# Altium schematic sheet BDSHOT_TX.SchDoc
size 420 x 297 mm; SheetNumber: 5; SheetTotal: 5
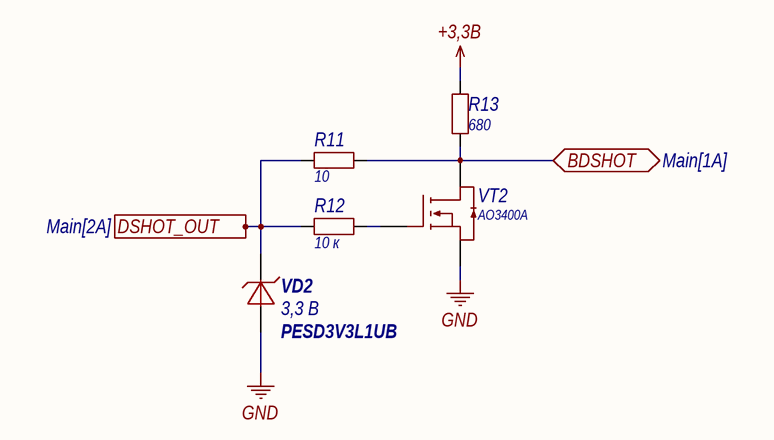
[diagram p0: BDSHOT_TX.SchDoc]

## Parts
R11  value 10  [0603R]  (hidden comment: Resistor)
R12  value 10 к  [0603R]  (hidden comment: Resistor)
R13  value 680  [0603R]  (hidden comment: Resistor)
VD2  PESD3V3L1UB  value 3,3 В  [SOD523]
VT2  AO3400A  [SOT23-3]

## Ports
BDSHOT (bidir, see Main[1A]), DSHOT_OUT (in, see Main[2A])

## Nets
+3,3В: R13.2
GND: VD2.1 VT2.2
BDSHOT: R11.2 R13.1 VT2.3 ; port BDSHOT
DSHOT_OUT: R11.1 R12.1 VD2.2 ; port DSHOT_OUT
NetR12_2: R12.2 VT2.1

## Notes on the sheet
- Перв. примен.
- Справ. №
- Подп. и дата
- Инв. № дубл.
- Взам. инв. №
- Разраб.
- Изм.
- Лист
- № докум.
- Подп.
- Дата
- Лит.
- Масса
- Масштаб
- Пров.
- Т.контр.
- Схема электрическая принципиальная
- Листов
- Инв. № подл.
- Утв.
- Н.контр.
- Копировал
- Формат А3

## Library data of the parts
R11 = Resistor_10_1_0603: Резистор номиналом 10 Ом и точностью 1%; Power: *; Part Number: Resistor_10_1_0603; Tolerance: 1%
R12 = Resistor_10k_1_0603: Резистор номиналом 10 кОм и точностью 1%; Power: *; Part Number: Resistor_10k_1_0603; Tolerance: 1%
R13 = Resistor_680_1_0603: Резистор номиналом 680 Ом и точностью 1%; Power: *; Part Number: Resistor_680_1_0603; Tolerance: 1%
VD2 = PESD3V3L1UB: Защитный диод на 3,3 В, рассеиваемая мощность 45 Вт; Voltage nominal (V): 3,3; Power (W): 45; Part Number: PESD3V3L1UB
VT2 = AO3400A: N-канальный MOSFET; Part Number: AO3400A